# Altium schematic sheet SOM_USB.SchDoc
size A3; CompanyName: NTB; Organization: NTB Interstate University of Applied; Address1: Werdenbergstrasse 4; Address3: 9471 Buchs; Address4: Switzerland; Organization1: Sciences of Technology Buchs; Size: A3
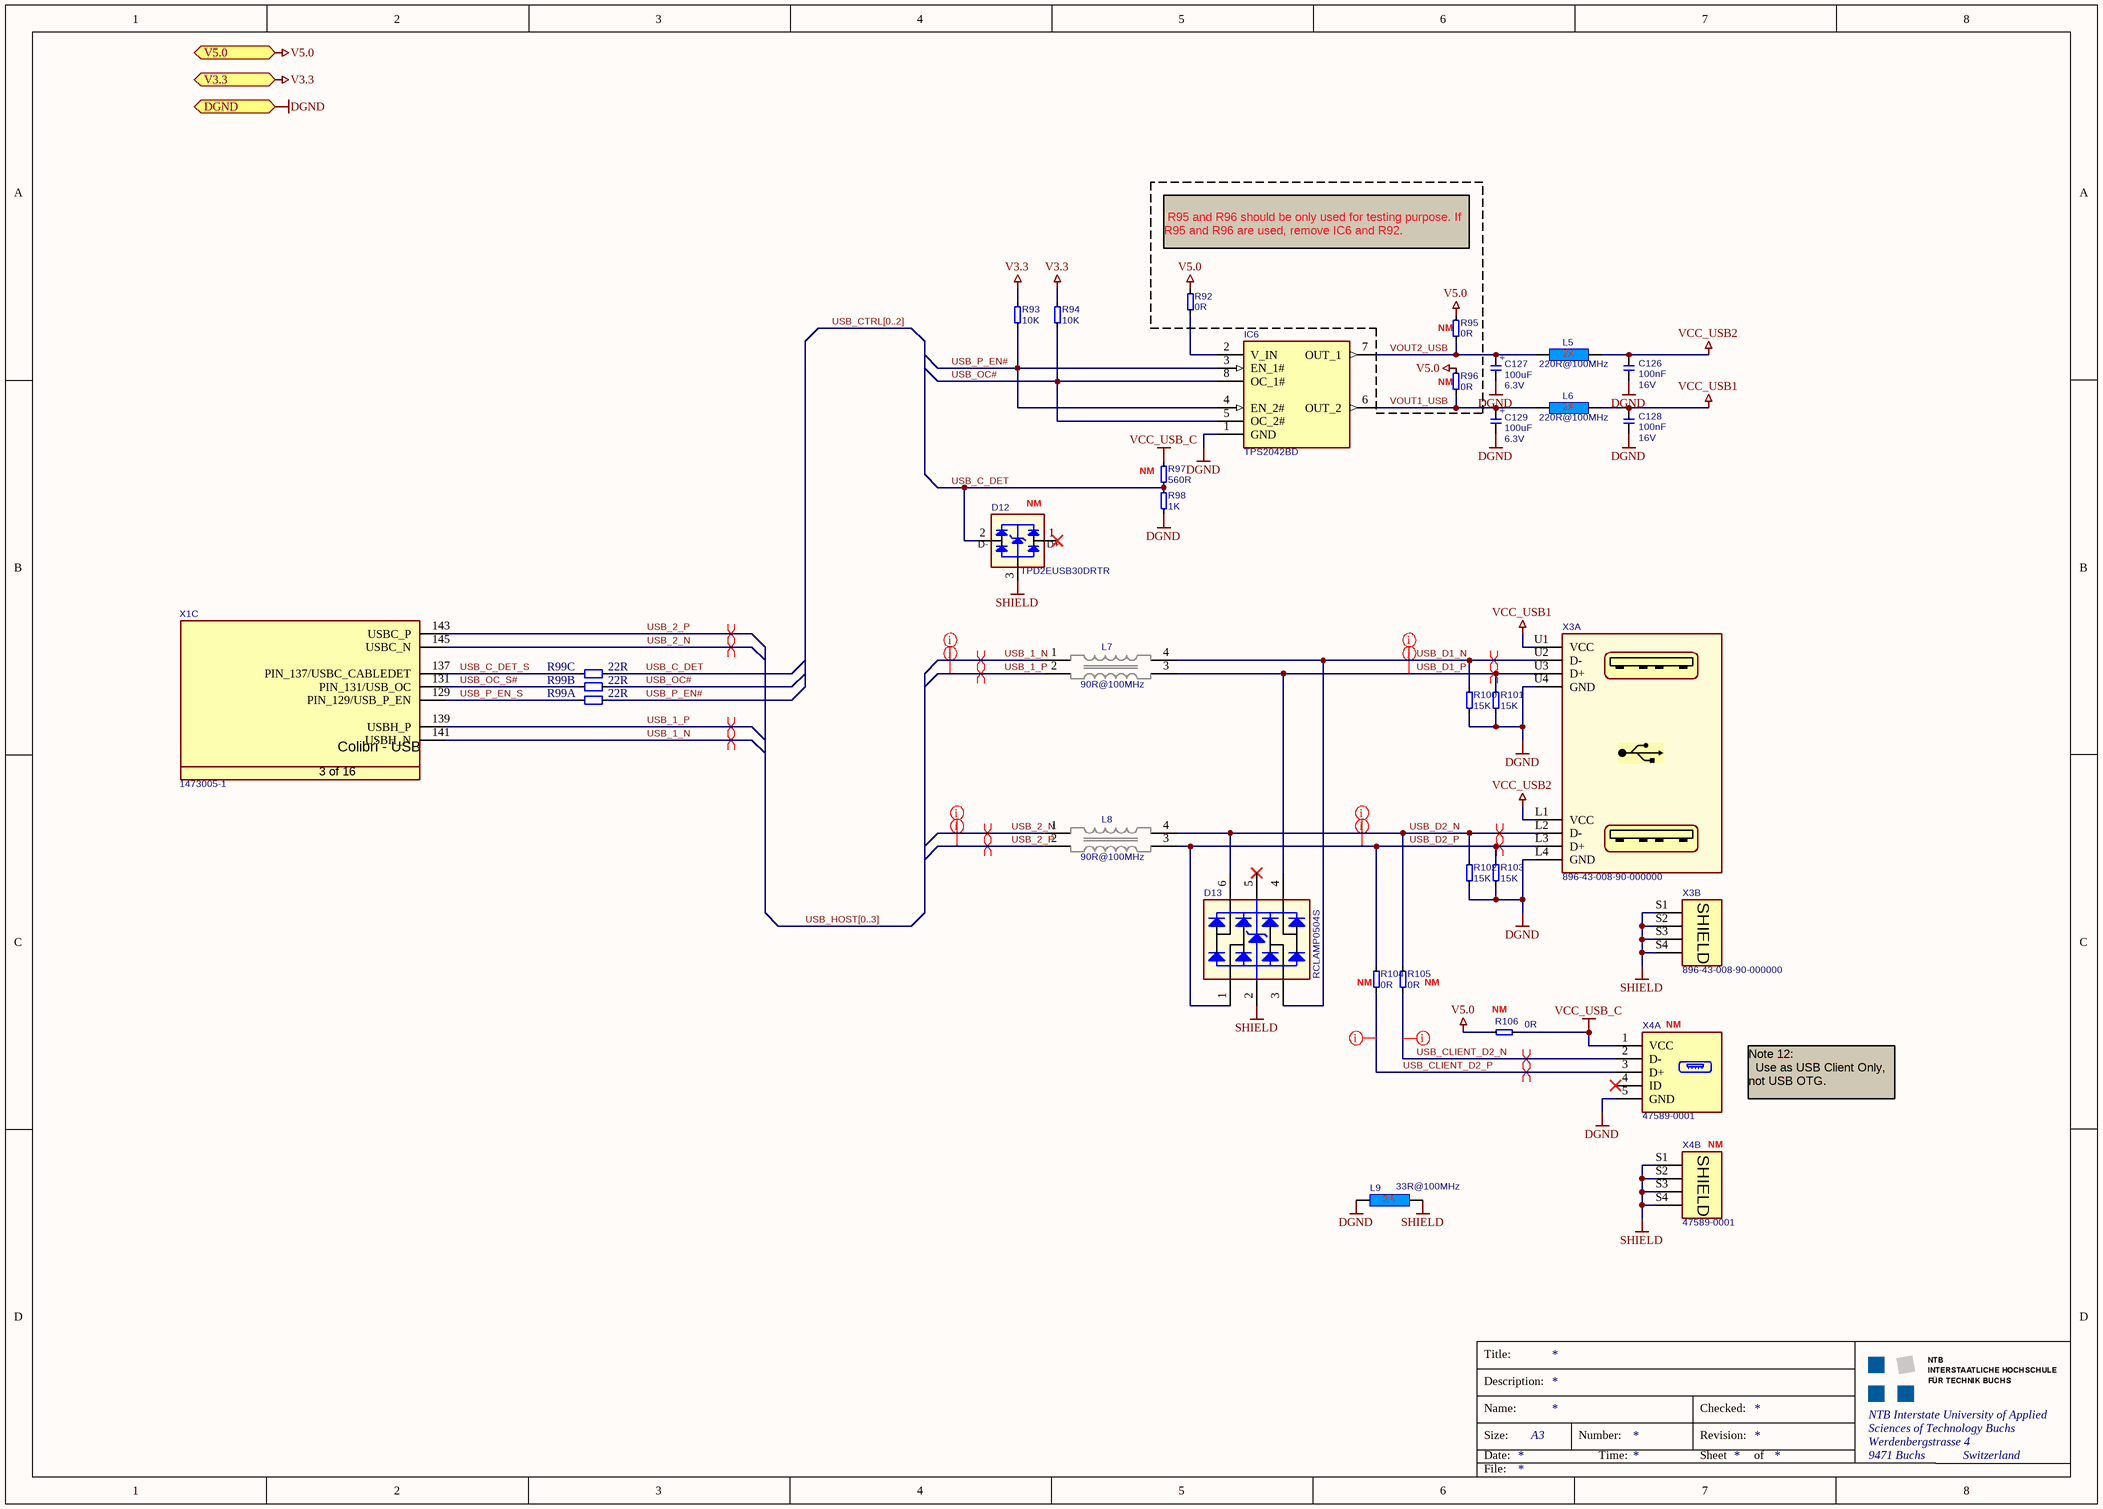
[diagram p0: SOM_USB.SchDoc]

## Parts
C126  Rating: 16V  [0603_3D]  (hidden comment: 100nF)
C127  Rating: 6.3V  [1206_Pol]  (hidden comment: 100uF)
C128  Rating: 16V  [0603_3D]  (hidden comment: 100nF)
C129  Rating: 6.3V  [1206_Pol]  (hidden comment: 100uF)
D12  TPD2EUSB30DRTR  [T_TI_TPD2EUSB30DRTR]
D13  RCLAMP0504S  [T_SOT95P285X90-6N]
IC6  TPS2042BD  [SOIC127P600X173-8N]
L5  220R@100MHz  [0603_3D]
L6  220R@100MHz  [0603_3D]
L7  90R@100MHz  [T_Murata_DLW21HN900SQ2]
L8  90R@100MHz  [T_Murata_DLW21HN900SQ2]
L9  33R@100MHz  [0603_3D]
R92  0R  [0603_3D]
R93  10K  [0603_3D]
R94  10K  [0603_3D]
R95  0R  [0603_3D]
R96  0R  [0603_3D]
R97  560R  [0603_3D]
R98  1K  [0603_3D]
R99  value 22R  [R_Array_CAT16-J4]  (hidden comment: R Array)  (parts A,B,C of 4)
R100  15K  [0603_3D]
R101  15K  [0603_3D]
R102  15K  [0603_3D]
R103  15K  [0603_3D]
R104  0R  [0603_3D]
R105  0R  [0603_3D]
R106  0R  [0603_3D]
X1  1473005-1  [T_Tyco_1473005-1]  (part C of 16)
X3  896-43-008-90-000000  [T_MMMC_896-43-008-90-000000]  (parts A,B of 2)
X4  Manufacturer Part Number: 47589-0001  [T_Molex_47589-0001]  (hidden comment: CON-Molex-47589-0001-5-0.65)  (parts A,B of 2)

## Ports
DGND, V3.3, V5.0

## Nets
DGND: C126.1 C127.2 C128.1 C129.2 IC6.1(GND) L9.1 R98.1 R100.1 R101.1 R102.1 R103.1 X3.L4(GND) X3.U4(GND) X4.5(GND) ; port DGND
SHIELD: D12.3 D13.2 L9.2 X3.S1(SHIELD) X3.S2(SHIELD) X3.S3(SHIELD) X3.S4(SHIELD) X4.S1(SHIELD) X4.S2(SHIELD) X4.S3(SHIELD) X4.S4(SHIELD)
V3.3: R93.2 R94.2 ; port V3.3
V5.0: R92.2 R95.2 R96.2 R106.2 ; port V5.0
VCC_USB1: C128.2 L6.2 X3.U1(VCC)
VCC_USB2: C126.2 L5.2 X3.L1(VCC)
VCC_USB_C: R97.2 R106.1 X4.1(VCC)
USB_1_N: L7.1 X1.141(USBH_N)
USB_1_P: L7.2 X1.139(USBH_P)
USB_2_N: L8.1 X1.145(USBC_N)
USB_2_P: L8.2 X1.143(USBC_P)
USB_C_DET: D12.2(D-) R97.1 R98.2 R99.2C
USB_C_DET_S: R99.1C X1.137(PIN_137/USBC_CABLEDET)
USB_CLIENT_D2_N: R105.1 X4.2(D-)
USB_CLIENT_D2_P: R104.1 X4.3(D+)
USB_D1_N: D13.3 L7.4 R100.2 X3.U2(D-)
USB_D1_P: D13.4 L7.3 R101.2 X3.U3(D+)
USB_D2_N: D13.6 L8.4 R102.2 R105.2 X3.L2(D-)
USB_D2_P: D13.1 L8.3 R103.2 R104.2 X3.L3(D+)
USB_OC#: IC6.5(OC_2#) IC6.8(OC_1#) R94.1 R99.2B
USB_OC_S#: R99.1B X1.131(PIN_131/USB_OC)
USB_P_EN#: IC6.3(EN_1#) IC6.4(EN_2#) R93.1 R99.2A
USB_P_EN_S: R99.1A X1.129(PIN_129/USB_P_EN)
VOUT1_USB: C129.1 IC6.6(OUT_2) L6.1 R96.1
VOUT2_USB: C127.1 IC6.7(OUT_1) L5.1 R95.1
NetIC6_2: IC6.2(V_IN) R92.1

Not connected (* = marked no-connect by the designer): D12 1(D+)*; D13 5*; X4 4(ID)*

## Buses and harness runs
bus USB_CTRL[0..2]
bus USB_HOST[0..3]

## Layout directives
differential pair: USB_1_N, USB_1_P, USB_2_N, USB_2_P, USB_CLIENT_D2_N, USB_CLIENT_D2_P, USB_D1_N, USB_D1_P, USB_D2_N, USB_D2_P
net class USB_1: USB_1_N, USB_1_P
net class USB_2: USB_2_N, USB_2_P
net class USB_D2: USB_D2_N, USB_D2_P
net class USB_D1: USB_D1_N, USB_D1_P
net class USB_CLIENT: USB_CLIENT_D2_N, USB_CLIENT_D2_P

## Notes on the sheet
- R95 and R96 should be only used for testing purpose. If R95 and R96 are used, remove IC6 and R92.
- (near R96) NM
- (near R95) NM
- (near D12) NM
- NM
- (near R104) NM
- (near R105) NM
- (near R106) NM
- (near X4) NM
- Note 12:
  Use as USB Client Only,    not USB OTG.
- Title:
- Description:
- Size:
- Date:
- Name:
- Number:
- Time:
- Revision:
- Sheet
- Checked:
- of
- File:
- (in symbol C-TA-100uF-10V-20%-3528) +
- (in symbol CON-Tyco-1473005-1-200-0.6mm, part C) Colibri - USB; 3 of 16
- (in symbol L-33R@100MHz-3A-0603) 3A

## Library data of the parts
C126 C128 = C-X7R-100nF-16V-10%-0603: Capacitor Ceramic X7R 100nF 16V 10% 0603; Manufacturer: Generic; Tolerance: 10%; Type: X7R; Value: 100nF; Manufacturer Part Number: *
C127 C129 = C-TA-100uF-10V-20%-3528: Capacitor TA 100uF 10V 20% 3528; Manufacturer: Generic; Tolerance: 20%; Type: TA; Value: 100uF; Manufacturer Part Number: *
D12 = D-TI-TPD2EUSB30DRTR: 2 Channel Protection for Super Speed USB3.0; Manufacturer: TI; Manufacturer Part Number: TPD2EUSB30DRTR
D13 = D-Semtech-RClamp0504S-ESD-5V-+/-8KV(Contact)-+/-15KV(Air): TVS Array low cap; Manufacturer: Semtech; Manufacturer Part Number: RCLAMP0504S
IC6 = IC-TI-TPS2042BD: Dual High Side Switch With OC_DET 500mA/CH; Manufacturer: Texas Instruments; Manufacturer Part Number: TPS2042BD
L5 L6 = L-220R@100MHz-2A-25%-0603: 220R@100MHz 2A EMI FILTER; Manufacturer: Generic; Tolerance: 25%; Rating: 2A; Value: 220R@100MHz; Manufacturer Part Number: *
L7 L8 = L-Murata-DLW21HN900SQ2-90R@100MHz-330mA-25%: Common Mode Choke High Speed 90R 330mA; Manufacturer: Murata; Tolerance: 25%; Rating: 330mA; Value: 90R@100MHz; Manufacturer Part Number: DLW21HN900SQ2
L9 = L-33R@100MHz-3A-0603: 33R@100MHz 3A EMI FILTER; Manufacturer: Generic; Rating: 2A; Tolerance: 25%; Manufacturer Part Number: *; Value: 33R@100MHz
R92 = R-0R-63mW-1%-1206: Resistor 0 ohm 63mW 1%1206 Jumper; Manufacturer: Generic; Tolerance: 1%; Rating: 63mW; Value: 0R; Manufacturer Part Number: *
R93 R94 = R-10KR-63mW-1%-0603: Resistor 10 Kohm 63mW 1% 0603; Manufacturer: Generic; Rating: 63mW; Tolerance: 1%; Value: 10K; Manufacturer Part Number: *
R95 R96 R104-R106 = R-0R-100mW-JP-0603: Resistor 0 ohm 100mW Jumper 0603; Manufacturer: Generic; Rating: 63mW; Tolerance: 1%; Value: 0R; Manufacturer Part Number: *
R97 = R-560R-63mW-5%-0603: Resistor 560 ohm 63mW 5% 0603; Manufacturer: Generic; Rating: 63mW; Tolerance: 5%; Value: 560R; Manufacturer Part Number: *
R98 = R-1KR-63mW-5%-0603: Resistor 1 Kohm 63mW 5% 0603; Manufacturer: Generic; Rating: 63mW; Tolerance: 5%; Value: 1K; Manufacturer Part Number: *
R99 = R_Array
R100-R103 = R-15KR-63mW-1%-0603: Resistor 15 Kohm 63mW 5% 0603; Manufacturer: Generic; Value: 15KR; Rating: 63mW; Tolerance: 5%; Manufacturer Part Number: *
X1 = CON-Tyco-1473005-1-200-0.6mm: SODIMM Connector; Manufacturer: Tyco; No. of ways: 200; Manufacturer Part Number: 1473005-1
X3 = CON-MMMC-896-43-008-90-000000: USB 2.0 double row, Type A; Manufacturer: Mill-Max Mfg. Corp.; No. of ways: 8; Manufacturer Part Number: 896-43-008-90-000000
X4 = CON-Molex-47589-0001-5-0.65: Micro USB OTG Connector; Manufacturer: Molex; No. of ways: 5